# EasyEDA Pro project ESP32-S3-DevKit-C1 自动灌溉拓展板.eprj

# Schematic Schematic1
Create Date: 2025-03-10; Page Name: P1; Project Name: ESP32S通用拓展板; Schematic Name: Schematic1; Update Date: 2025-03-11; Company: 嘉立创EDA; Page Size: A4; Version: V1.0
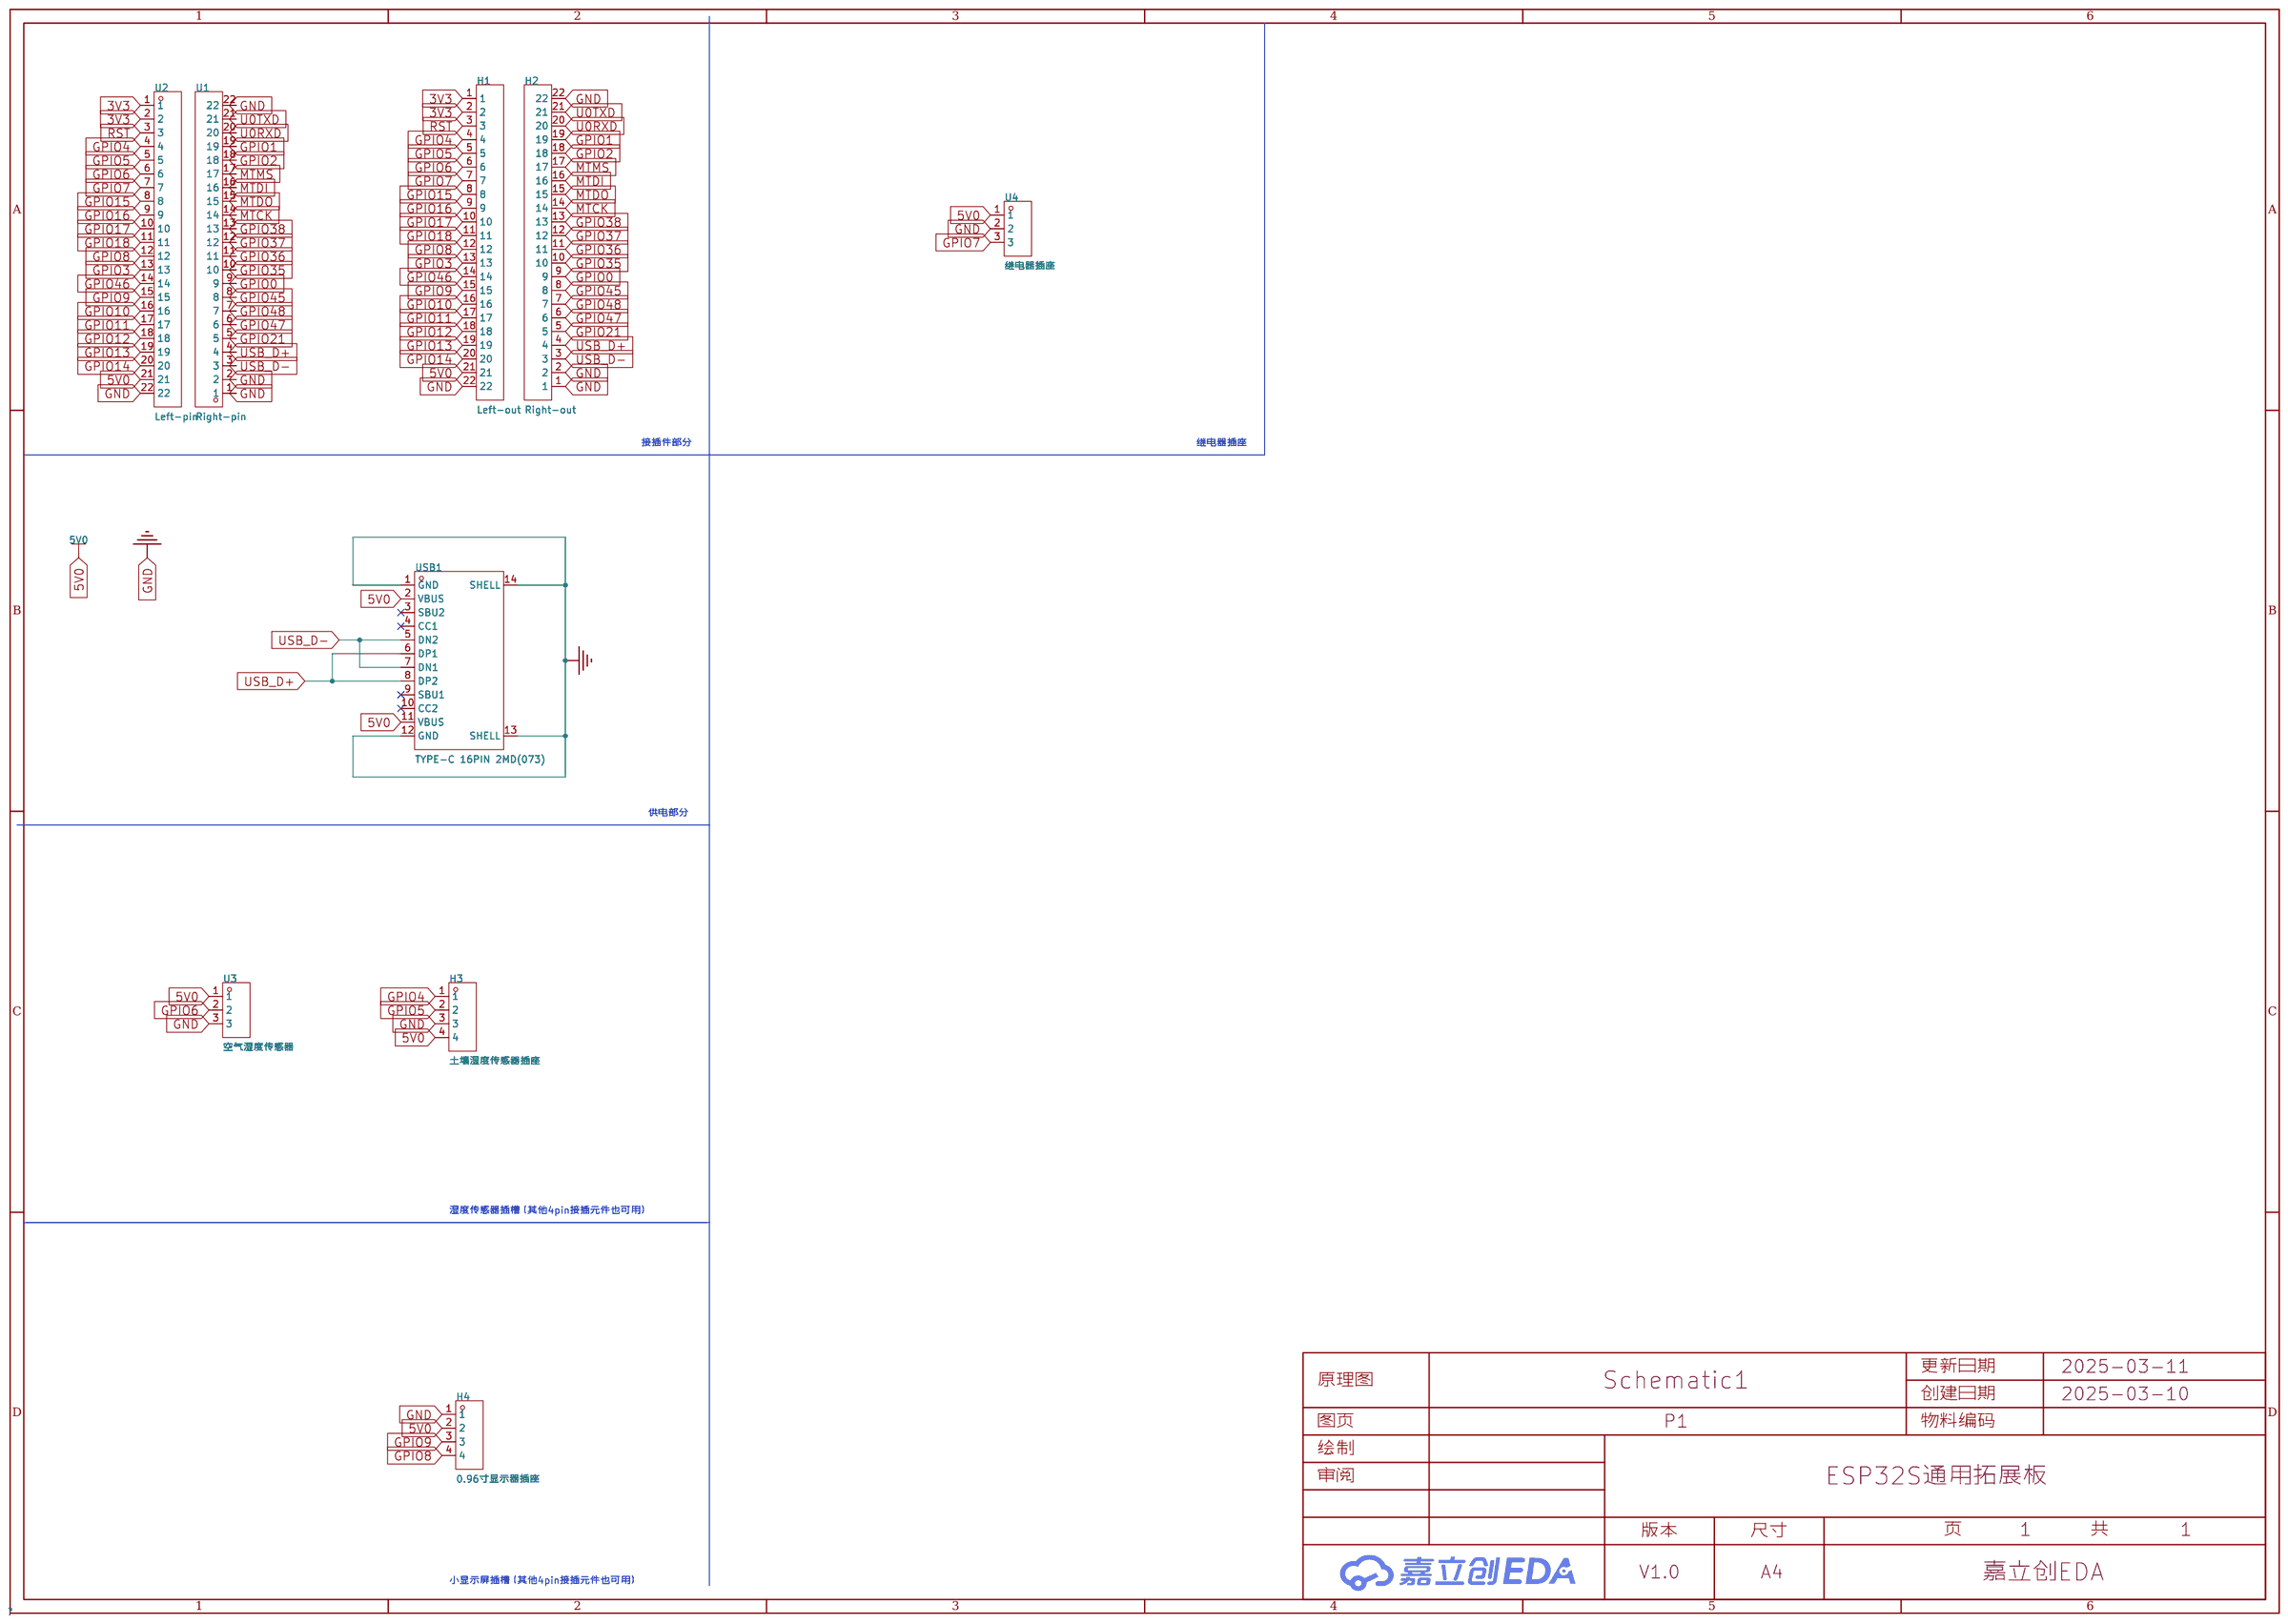
[diagram p0: schematic sheet]

## Parts
H1  Left-out  [HDR-TH_22P-P2.54-V-M]
H2  Right-out  [HDR-TH_22P-P2.54-V-M]
H3  土壤湿度传感器插座  [HDR-TH_4P-P2.54-V-F]
H4  0.96寸显示器插座  [HDR-TH_4P-P2.54-V-F]
U1  Right-pin  [HDR-TH_22P-P2.54-V-F]
U2  Left-pin  [HDR-TH_22P-P2.54-V-F]
U3  空气湿度传感器  [HDR-TH_3P-P2.54_CS-1165SDIG]
U4  继电器插座  [HDR-TH_3P-P2.54_CS-1165SDIG]
USB1  TYPE-C 16PIN 2MD(073)  [USB-C-SMD_TYPE-C-6PIN-2MD-073]

## Library data of the parts
H1 H2 = X6511WV-22H-C60D30: 插针结构:1x22P;间距:2.54mm;行距:2.54mm;圆针/方针:方针;排数:单排;总PIN位数:22P;额定电流:3A;额定电压:250V;配合针长度:-;塑高:2.5mm;端接针长度:-;触头材质:黄铜;触头镀层:金;工作温度:-40℃~+105℃;颜色:黑色;; LCSC Part Name: 1x22P 间距:2.54mm 方针; Supplier Part: C725954; Manufacturer: XKB Connection(中国星坤); Supplier Footprint: 插件,P=2.54mm; JLCPCB Part Class: 扩展库; Datasheet: https://atta.szlcsc.com/upload/public/pdf/source/20221108/2FDDF9C694C8EDC81165E23F2EAAE597.pdf; Supplier: LCSC; Pin Structure: 1x22P; Pitch: 2.54mm; Row Spacing: 2.54mm; Circluar Pins/Square Pins: 方针; Number of Rows: 单排; Number of Pins: 22P; Current Rating: 3A; Voltage Rating (Max): 250V; Insulation Height: 2.5mm; Contact Material: 黄铜; Contact Plating: 金; Operating Temperature: -40℃~+105℃; Color: 黑色
H3 H4 = 2.54-1*4P母: 插孔结构:1x4P;间距:2.54mm;行距:-;圆孔/方孔:方孔;安装类型:直插;排数:单排;总孔位数:4P;额定电流:3A;额定电压:-;插孔方向:顶部;塑高:-;触头材质:青铜;触头镀层:-;工作温度范围:-40℃~+105℃;焊接温度(最大值):-;; LCSC Part Name: 间距:2.54mm 1x4P 直插; Supplier Part: C2718488; Manufacturer: BOOMELE(博穆精密); Supplier Footprint: 插件,P=2.54mm; JLCPCB Part Class: 扩展库; Datasheet: https://atta.szlcsc.com/upload/public/pdf/source/20210301/C2718488_F4427B881E42CAA8DDB0B1C12B3A522C.pdf; Supplier: LCSC; Holes Structure: 1x4P; Pitch: 2.54mm; Circular Hole / Square Hole: 方孔; Mounting Type: 直插; Number of Rows: 单排; Number of Holes: 4P; Current Rating (Max): 3A; Holes Direction: 顶部; Contact Material: 青铜; Operating Temperature Range: -40℃~+105℃
U1 U2 = ZX-PM2.54-1-22PY: 插孔结构:1x22P;间距:2.54mm;行距:-;圆孔/方孔:方孔;安装类型:直插;排数:单排;总孔位数:22P;额定电流:-;额定电压:1kV;插孔方向:顶部;塑高:8.5mm;触头材质:-;触头镀层:金;工作温度范围:-40℃~+105℃;焊接温度(最大值):260℃@5S;; LCSC Part Name: 1x22P 间距:2.54mm 直插; Supplier Part: C7499337; Manufacturer: Megastar(兆星); Supplier Footprint: 插件,P=2.54mm; JLCPCB Part Class: 扩展库; Datasheet: https://atta.szlcsc.com/upload/public/pdf/source/20231122/9A7AD1561672B326C4FDCF441604BC5A.pdf; Supplier: LCSC; Holes Structure: 1x22P; Pitch: 2.54mm; Circular Hole / Square Hole: 方孔; Mounting Type: 直插; Number of Rows: 单排; Number of Holes: 22P; Voltage Rating (Max): 1kV; Holes Direction: 顶部; Insulation Height: 8.5mm; Contact Plating: 金; Operating Temperature Range: -40℃~+105℃; Soldering Temperature(Max): 260℃@5S
U3 U4 = 排母2.54mm 1X3pin: Supplier Part: C9900016709; JLCPCB Part Class: 扩展库; Supplier: LCSC
USB1 = TYPE-C 16PIN 2MD(073): 连接器类型:Type-C;标准:USB 3.1;公母:母;安装方式:卧贴;触点数量:16P;端口数量:1;额定电流 - 电源:5A;工作温度范围:-25℃~+85℃;; LCSC Part Name: Type-C 母 卧贴; Supplier Part: C2765186; Manufacturer: SHOU HAN(首韩); Supplier Footprint: SMD; JLCPCB Part Class: 扩展库; Datasheet: https://atta.szlcsc.com/upload/public/pdf/source/20211123/39B17C16241EAC15C5E277BDA434118E.pdf; Supplier: LCSC; Connector Type: Type-C; Standard: USB 3.1; Gender: 母; Mounting Style: 卧贴; Number of Contacts: 16P; Number of Ports: 1; Current Rating - Power (Max): 5A; Operating Temperature Range: -25℃~+85℃; Rated Voltage (Max): 5V; Connect-Disconnect Life: 5千次; Core Colour: 黑色

## Nets
3V3: H1.1 H1.2 U2.1 U2.2
5V0: H1.21 H3.4 H4.2 U2.21 U3.1 U4.1 USB1.2(VBUS) USB1.11(VBUS)
GND: H1.22 H2.1 H2.2 H2.22 H3.3 H4.1 U1.1 U1.2 U1.22 U2.22 U3.3 U4.2 USB1.1(GND) USB1.12(GND) USB1.13(SHELL) USB1.14(SHELL)
GPIO0: H2.9 U1.9
GPIO1: H2.19 U1.19
GPIO2: H2.18 U1.18
GPIO3: H1.13 U2.13
GPIO4: H1.4 H3.1 U2.4
GPIO5: H1.5 H3.2 U2.5
GPIO6: H1.6 U2.6 U3.2
GPIO7: H1.7 U2.7 U4.3
GPIO8: H1.12 H4.4 U2.12
GPIO9: H1.15 H4.3 U2.15
GPIO10: H1.16 U2.16
GPIO11: H1.17 U2.17
GPIO12: H1.18 U2.18
GPIO13: H1.19 U2.19
GPIO14: H1.20 U2.20
GPIO15: H1.8 U2.8
GPIO16: H1.9 U2.9
GPIO17: H1.10 U2.10
GPIO18: H1.11 U2.11
GPIO21: H2.5 U1.5
GPIO35: H2.10 U1.10
GPIO36: H2.11 U1.11
GPIO37: H2.12 U1.12
GPIO38: H2.13 U1.13
GPIO45: H2.8 U1.8
GPIO46: H1.14 U2.14
GPIO47: H2.6 U1.6
GPIO48: H2.7 U1.7
MTCK: H2.14 U1.14
MTDI: H2.16 U1.16
MTDO: H2.15 U1.15
MTMS: H2.17 U1.17
RST: H1.3 U2.3
U0RXD: H2.20 U1.20
U0TXD: H2.21 U1.21
USB_D+: H2.4 U1.4 USB1.6(DP1) USB1.8(DP2)
USB_D-: H2.3 U1.3 USB1.5(DN2) USB1.7(DN1)

Not connected (* = marked no-connect by the designer): USB1 3(SBU2)* 4(CC1)* 9(SBU1)* 10(CC2)*

## Notes on the sheet
- 接插件部分
- 继电器插座
- 供电部分
- 湿度传感器插槽（其他4pin接插元件也可用）
- 小显示屏插槽（其他4pin接插元件也可用）

# Board PCB1
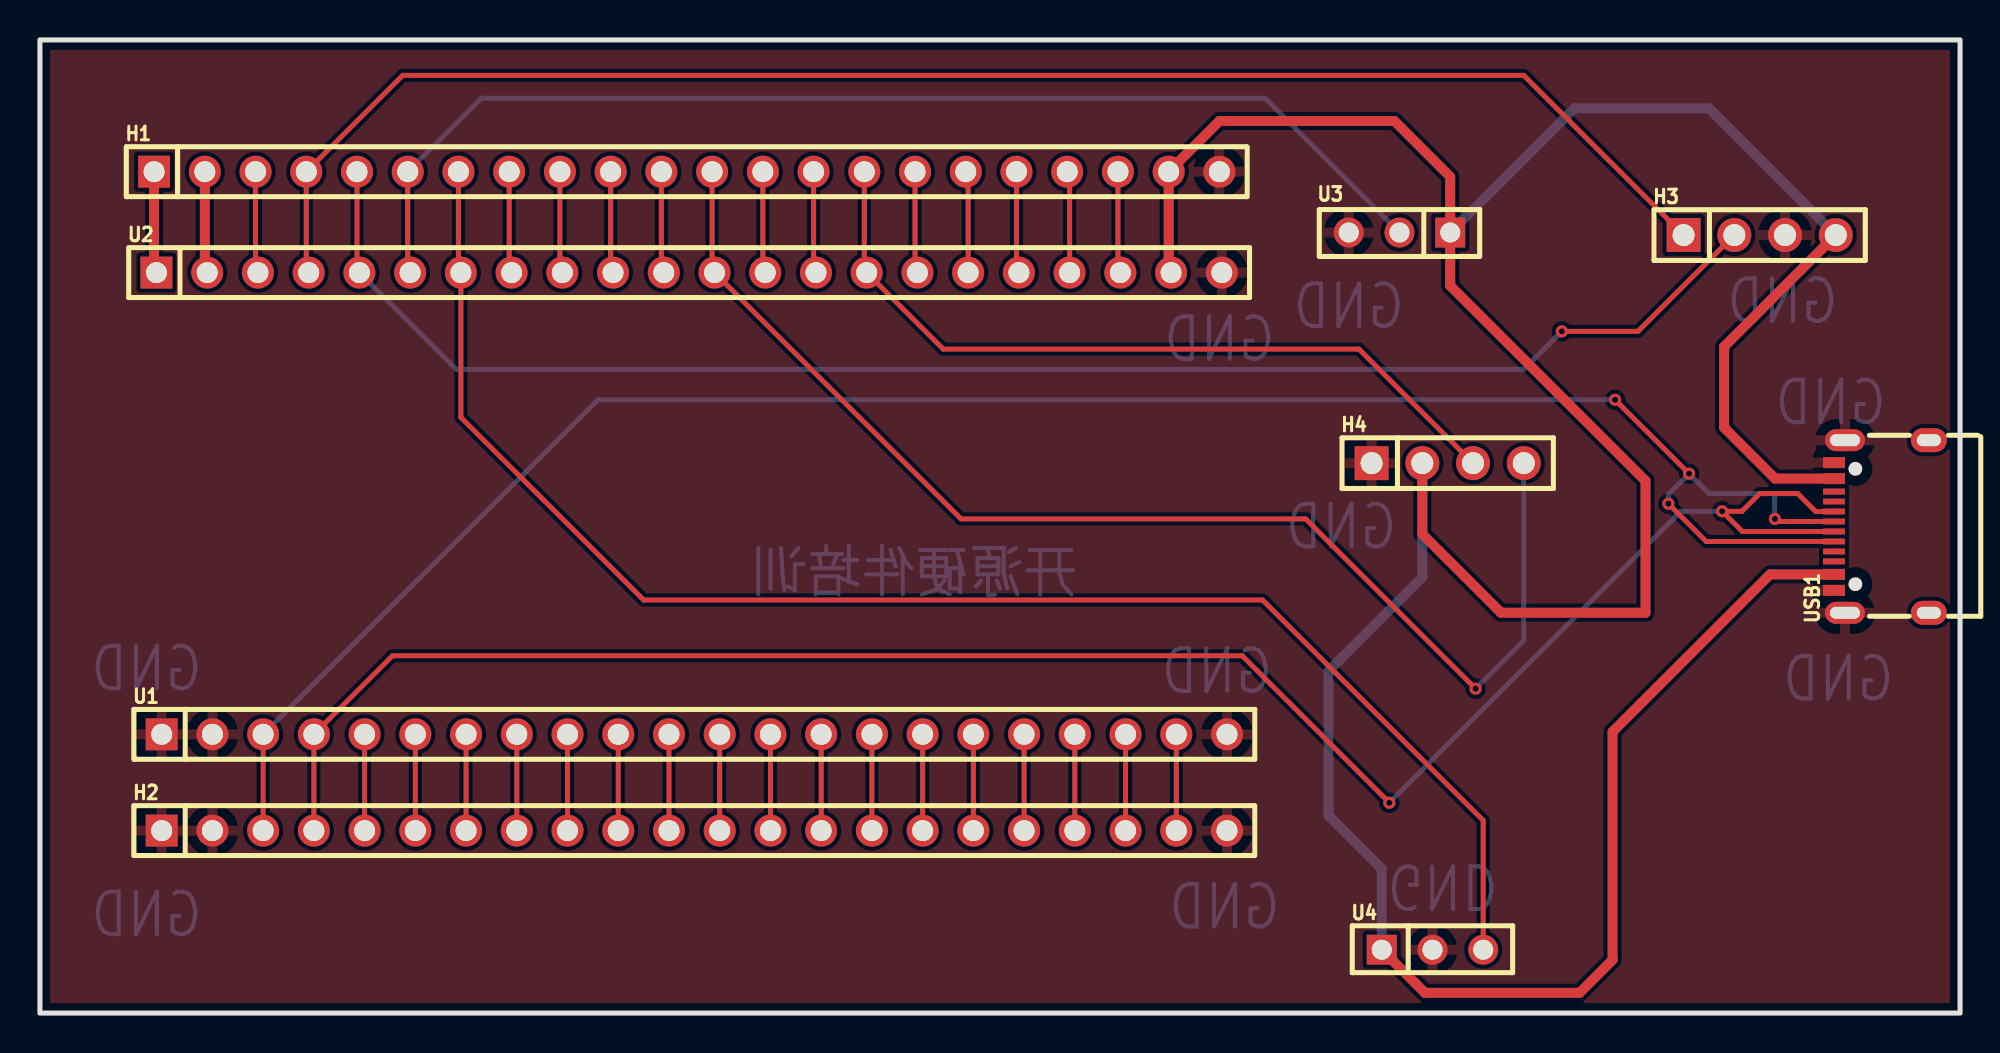
[diagram p1: board, top side]
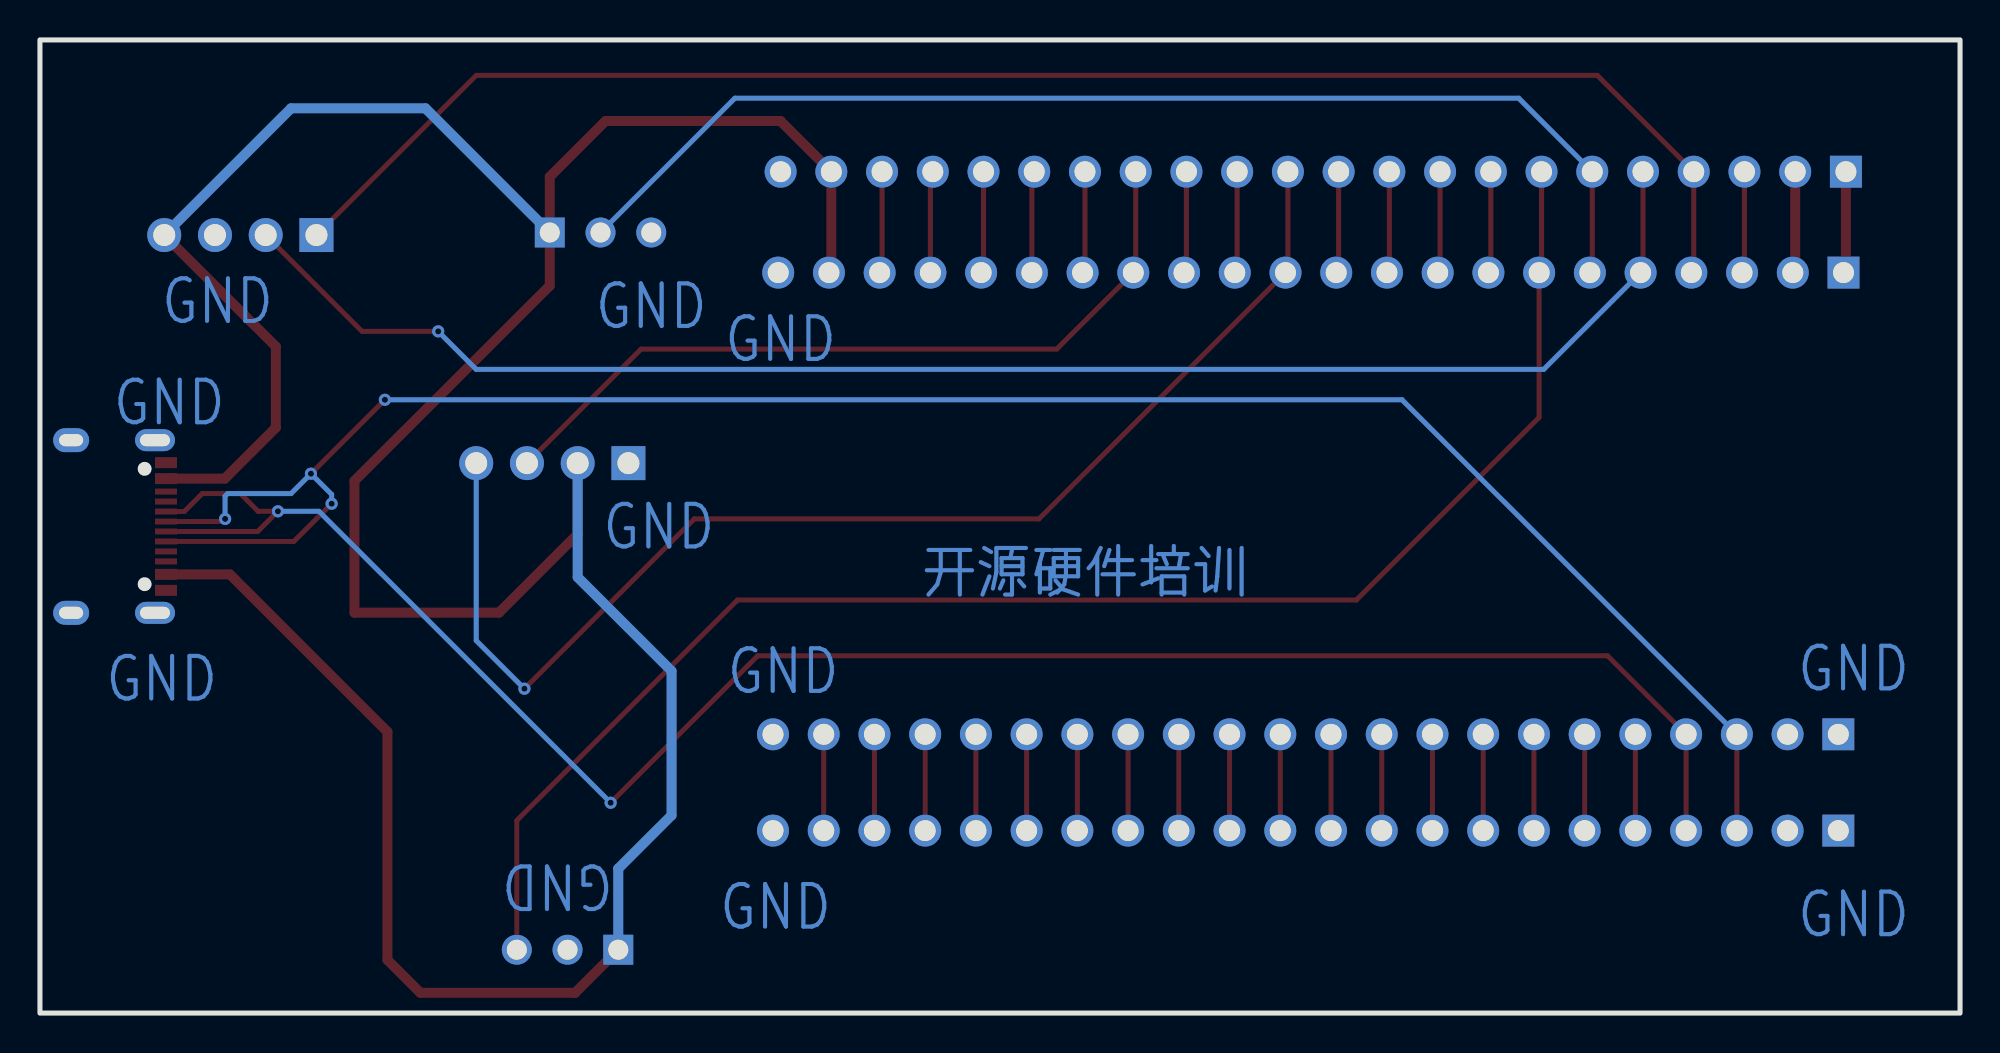
[diagram p2: board, bottom side, seen from below]

Outline 96.14 x 48.77 mm; copper layers: Top Layer, Bottom Layer. Coordinates in mm from the lower left corner of the outline.
Outline path: rectangle 0,48.77 96.14,0
Stack: Top Layer 0.035mm - / Dielectric1 1.51mm FR4 er 4.5 / Bottom Layer 0.035mm -

## Design rules (mm)
template: JLCPCB Capability(Two Layers Board)
spacing copperThickness1oz (default): track to track 0.102, other pairs 0.152 to 0.3
spacing copperThickness2oz: track to track 0.203, other pairs 0.152 to 0.3
track width copperThickness1oz (default): min 0.127, default 0.254, max 2.54
track width copperThickness2oz: min 0.203, default 0.254, max 2.54
differential pair differentialPair (default): width min 0.127, default 0.254, max 2.54; gap min 0.152, default 0.152
via viaSize (default): diameter min 0.5, default 0.61, max 10; hole min 0.3, default 0.305, max 6.3

## Placement (name value [footprint] x y rotation side)
H1  Left-out  [HDR-TH_22P-P2.54-V-M]  32.38 42.16 0 top
H2  Right-out  [HDR-TH_22P-P2.54-V-M]  32.77 9.14 0 top
H3  土壤湿度传感器插座  [HDR-TH_4P-P2.54-V-F]  86.11 38.99 0 top
H4  0.96寸显示器插座  [HDR-TH_4P-P2.54-V-F]  70.48 27.56 0 top
U1  Right-pin  [HDR-TH_22P-P2.54-V-F]  32.77 13.97 0 top
U2  Left-pin  [HDR-TH_22P-P2.54-V-F]  32.5 37.11 0 top
U3  空气湿度传感器  [HDR-TH_3P-P2.54_CS-1165SDIG]  68.07 39.12 180 top
U4  继电器插座  [HDR-TH_3P-P2.54_CS-1165SDIG]  69.72 3.17 0 top
USB1  TYPE-C 16PIN 2MD(073)  [USB-C-SMD_TYPE-C-6PIN-2MD-073]  92.2 24.38 90 top

## Footprints (pads in the part's own frame, mm; a bottom-side part is the same pattern mirrored in y, then rotated)
HDR-TH_3P-P2.54_CS-1165SDIG
  rect 1.5x1.5 hole 1: 1(-2.54,0)
  round 1.5 hole 1: 2(0,0) 3(2.54,0)
HDR-TH_4P-P2.54-V-F
  rect 1.7x1.7 hole 1.1: 1(-3.81,0)
  round 1.7 hole 1.1: 2(-1.27,0) 3(1.27,0) 4(3.81,0)
HDR-TH_22P-P2.54-V-F
  rect 1.6x1.6 hole 1.05: 1(-26.67,0)
  round 1.6 hole 1.05: 2(-24.13,0) 3(-21.59,0) 4(-19.05,0) 5(-16.51,0) 6(-13.97,0) 7(-11.43,0) 8(-8.89,0) 9(-6.35,0) 10(-3.81,0) 11(-1.27,0) 12(1.27,0) 13(3.81,0) 14(6.35,0) 15(8.89,0) 16(11.43,0) 17(13.97,0) 18(16.51,0) 19(19.05,0) 20(21.59,0) 21(24.13,0) 22(26.67,0)
HDR-TH_22P-P2.54-V-M
  rect 1.6x1.6 hole 1.05: 1(-26.67,0)
  round 1.6 hole 1.05: 2(-24.13,0) 3(-21.59,0) 4(-19.05,0) 5(-16.51,0) 6(-13.97,0) 7(-11.43,0) 8(-8.89,0) 9(-6.35,0) 10(-3.81,0) 11(-1.27,0) 12(1.27,0) 13(3.81,0) 14(6.35,0) 15(8.89,0) 16(11.43,0) 17(13.97,0) 18(16.51,0) 19(19.05,0) 20(21.59,0) 21(24.13,0) 22(26.67,0)
USB-C-SMD_TYPE-C-6PIN-2MD-073
  rect 0.55x1.1 smd: 1(-3.2,2.375) 2(-2.4,2.375) 11(2.4,2.375) 12(3.2,2.375)
  rect 0.3x1.1 smd: 3(-1.75,2.375) 4(-1.25,2.375) 5(-0.75,2.375) 6(-0.25,2.375) 7(0.25,2.375) 8(0.75,2.375) 9(1.25,2.375) 10(1.75,2.375)
  oval 1.1x2 hole 0.6x1.5: 13(-4.325,1.825) 14(4.325,1.825)
  oval 1.2x1.8 hole 0.6x1.2: 13(-4.325,-2.375) 14(4.325,-2.375)

## Nets
As in the schematic.

Pads without a net: USB1 3 4 9 10

## Via types
v1: diameter 0.61, hole 0.305, Top Layer to Bottom Layer, 8 vias

## Routing (per net, layer and track width the routed paths; a pad name or vN(x,y) marks a point on that pad's centre or on a via; arc(x,y) is an arc through that point)
3V3: length 10.2
  Top Layer w0.254: 8.25,37.23 U2.2
  Top Layer w0.5: U2.1 5.71,37.23 H1.1 ; H1.2 8.25,37.23
5V0: length 173.1
  Top Layer w0.5: H3.4 84.33,33.4 84.33,29.34 86.88,26.78 USB1.11 ; 69.22,27.56 69.22,24 73.15,20.07 80.39,20.07 80.39,26.67 70.61,36.45 U3.1 70.61,41.91 67.82,44.7 59.06,44.7 H1.21 56.51,37.23 U2.21 ; U4.1 69.34,1.02 77.09,1.02 78.74,2.67 78.74,14.1 86.63,21.98 89.83,21.98
  Bottom Layer w0.5: U4.1 67.18,7.24 64.52,9.91 64.52,17.14 69.22,21.84 69.22,27.56 ; U3.1 76.84,45.34 83.57,45.34 H3.4
GPIO0: length 4.8
  Top Layer w0.25: U1.9 H2.9
GPIO1: length 4.8
  Top Layer w0.25: U1.19 H2.19
GPIO2: length 4.8
  Top Layer w0.25: U1.18 H2.18
GPIO3: length 5.1
  Top Layer w0.254: H1.13 36.19,37.23 U2.13
GPIO4: length 79.4
  Top Layer w0.25: H3.1 74.29,46.99 18.16,46.99 H1.4
  Top Layer w0.254: H1.4 13.33,37.23 U2.4
GPIO5: length 78.7
  Top Layer w0.25: v1(76.2,34.16) 80.01,34.16 H3.2
  Top Layer w0.254: 15.88,42.16 15.88,37.23 U2.5
  Bottom Layer w0.25: U2.5 20.84,32.26 74.29,32.26 v1(76.2,34.16)
GPIO6: length 59.1
  Top Layer w0.254: U2.6 18.41,37.23 H1.6
  Bottom Layer w0.25: U3.2 61.34,45.85 22.1,45.85 H1.6
GPIO7: length 78.4
  Top Layer w0.25: 72.26,3.17 72.26,9.65 61.21,20.7 30.23,20.7 21.07,29.85 U2.7
  Top Layer w0.254: 20.95,42.16 20.95,37.23 U2.7
GPIO8: length 64.2
  Top Layer w0.25: v1(71.88,16.26) 63.37,24.76 46.12,24.76 U2.12
  Top Layer w0.254: U2.12 33.66,37.23 H1.12
  Bottom Layer w0.25: v1(71.88,16.26) 74.29,18.67 H4.4
GPIO9: length 39.4
  Top Layer w0.25: H4.3 66.04,33.27 45.23,33.27 U2.15
  Top Layer w0.254: H1.15 41.28,37.23 U2.15
GPIO10: length 5.1
  Top Layer w0.254: H1.16 43.81,37.23 U2.16
GPIO11: length 5.1
  Top Layer w0.254: U2.17 46.47,42.04 H1.17
GPIO12: length 5.1
  Top Layer w0.254: U2.18 48.89,37.23 H1.18
GPIO13: length 5.1
  Top Layer w0.254: H1.19 51.56,42.04 U2.19
GPIO14: length 5.1
  Top Layer w0.254: H1.20 53.97,37.23 U2.20
GPIO15: length 5.1
  Top Layer w0.254: U2.8 23.5,37.23 23.5,42.16
GPIO16: length 5.1
  Top Layer w0.254: H1.9 26.03,37.23 U2.9
GPIO17: length 5.1
  Top Layer w0.254: H1.10 28.57,37.23 U2.10
GPIO18: length 5.1
  Top Layer w0.254: H1.11 31.11,37.23 U2.11
GPIO21: length 4.8
  Top Layer w0.25: U1.5 H2.5
GPIO35: length 4.8
  Top Layer w0.25: U1.10 H2.10
GPIO36: length 4.8
  Top Layer w0.25: U1.11 H2.11
GPIO37: length 4.8
  Top Layer w0.25: U1.12 H2.12
GPIO38: length 4.8
  Top Layer w0.25: U1.13 H2.13
GPIO45: length 4.8
  Top Layer w0.25: U1.8 H2.8
GPIO46: length 5.1
  Top Layer w0.254: H1.14 38.73,37.23 U2.14
GPIO47: length 4.8
  Top Layer w0.25: U1.6 H2.6
GPIO48: length 4.8
  Top Layer w0.25: U1.7 H2.7
MTCK: length 4.8
  Top Layer w0.25: U1.14 H2.14
MTDI: length 4.8
  Top Layer w0.25: U1.16 H2.16
MTDO: length 4.8
  Top Layer w0.25: U1.15 H2.15
MTMS: length 4.8
  Top Layer w0.25: U1.17 H2.17
RST: length 5.1
  Top Layer w0.254: H1.3 10.79,37.23 U2.3
U0RXD: length 4.8
  Top Layer w0.25: U1.20 H2.20
U0TXD: length 4.8
  Top Layer w0.25: U1.21 H2.21
USB_D+: length 98.5
  Top Layer w0.25: H2.4 U1.4 17.65,17.91 60.2,17.91 v1(67.56,10.54) ; USB1.8 88.91,25.13 88.01,26.03 86.11,26.03 85.22,25.15 v1(84.22,25.15) ; USB1.6 85.24,24.13 v1(84.22,25.15) ; v1(84.22,25.15) 84.11,25.15
  Bottom Layer w0.25: v1(84.22,25.15) 82.17,25.15 v1(67.56,10.54)
USB_D-: length 104.6
  Top Layer w0.25: v1(86.87,24.76) 87,24.63 USB1.7 ; v1(78.87,30.73) v1(82.57,27.03) ; v1(81.53,25.53) 83.43,23.63 USB1.5 ; H2.3 U1.3
  Bottom Layer w0.25: v1(86.87,24.76) 86.87,25.91 86.74,26.03 83.57,26.03 v1(82.57,27.03) 81.53,25.99 v1(81.53,25.53) ; v1(78.87,30.73) 27.94,30.73 U1.3

## Copper pours and planes (outline as drawn; the poured copper is in the pictures)
GND on Top Layer: 0,48.64 96.14,48.64 96.14,-0.13 0,-0.13

## Text on the board
Bottom Layer: GND | 开源硬件培训
